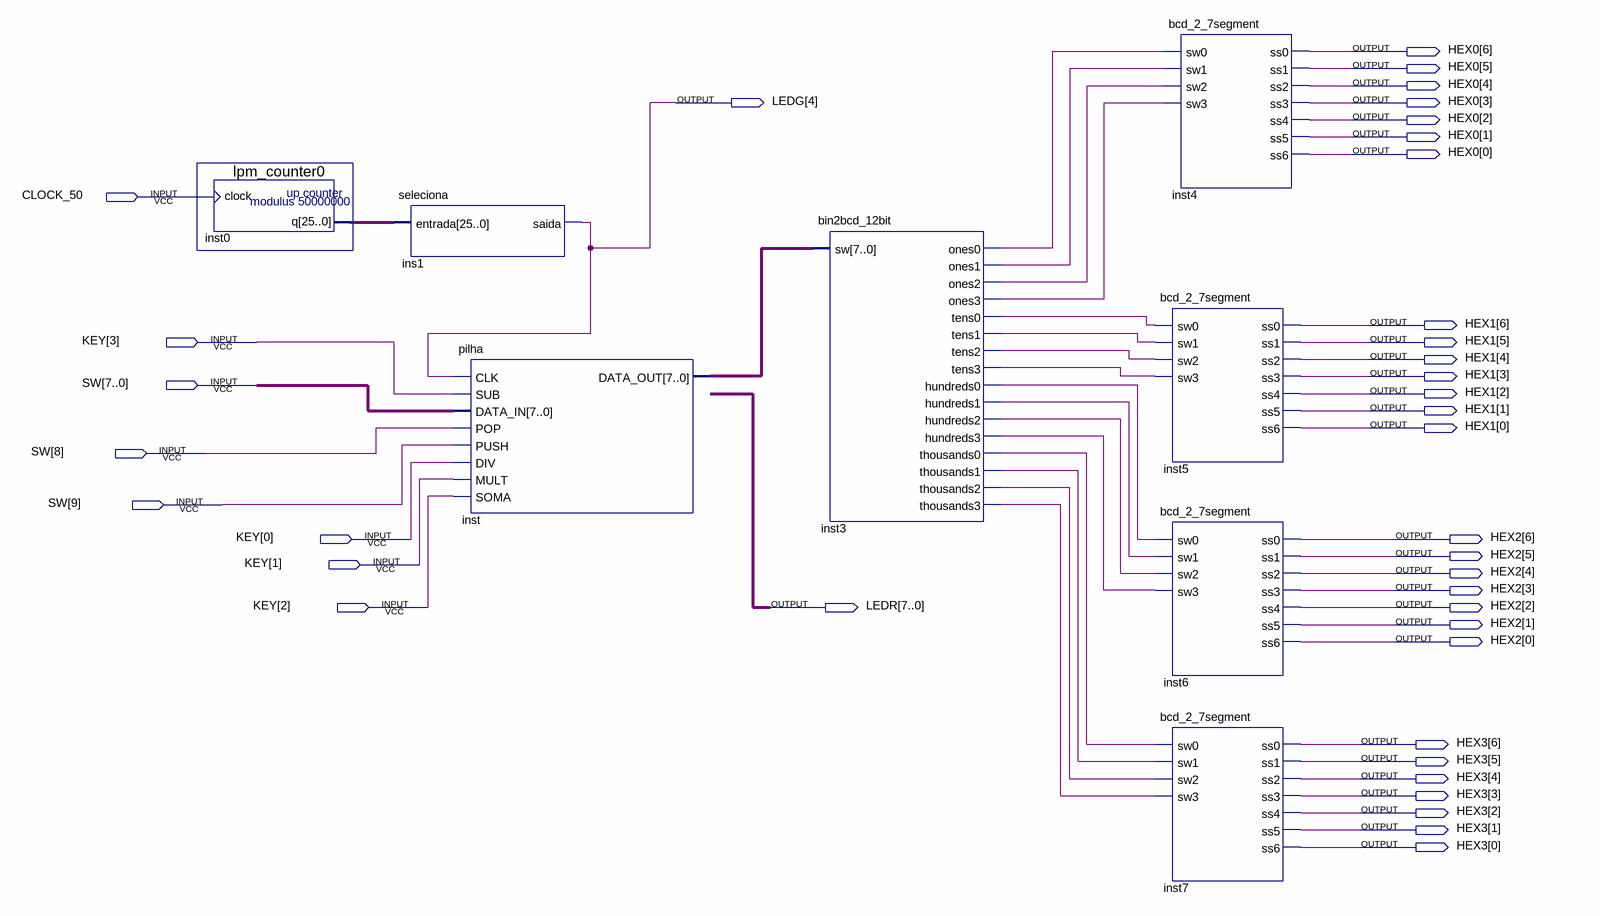
[diagram p0: schematic sheet]
// Quartus schematic bcd.bdf as structural Verilog: 8 symbols, 38 pins
module bcd (
  input  CLOCK_50,
  input  [3:0] KEY,
  input  [9:0] SW,
  output [6:0] HEX0,
  output [4:4] LEDG,
  output [6:0] HEX1,
  output [6:0] HEX2,
  output [7:0] LEDR,
  output [6:0] HEX3
);

  wire inst3_hundreds0, inst3_hundreds1, inst3_hundreds2, inst3_hundreds3, inst3_ones0, inst3_ones1,
       inst3_ones2, inst3_ones3, inst3_tens0, inst3_tens1, inst3_tens2, inst3_tens3, inst3_thousands0,
       inst3_thousands1, inst3_thousands2, inst3_thousands3;
  wire [7:0] inst_data_out;
  wire [25:0] inst0_q;

  lpm_counter0 inst0 (.clock(CLOCK_50), .q(inst0_q));
  seleciona ins1 (.entrada(inst0_q), .saida(LEDG[4]));
  pilha inst (
    .CLK(LEDG[4]), .SUB(KEY[3]), .DATA_IN(SW[7:0]), .POP(SW[8]), .PUSH(SW[9]), .DIV(KEY[0]), .MULT(KEY[1]),
    .SOMA(KEY[2]), .DATA_OUT(inst_data_out));
  bin2bcd_12bit inst3 (
    .sw(inst_data_out), .ones0(inst3_ones0), .ones1(inst3_ones1), .ones2(inst3_ones2), .ones3(inst3_ones3),
    .tens0(inst3_tens0), .tens1(inst3_tens1), .tens2(inst3_tens2), .tens3(inst3_tens3),
    .hundreds0(inst3_hundreds0), .hundreds1(inst3_hundreds1), .hundreds2(inst3_hundreds2),
    .hundreds3(inst3_hundreds3), .thousands0(inst3_thousands0), .thousands1(inst3_thousands1),
    .thousands2(inst3_thousands2), .thousands3(inst3_thousands3));
  bcd_2_7segment inst4 (
    .sw0(inst3_ones0), .sw1(inst3_ones1), .sw2(inst3_ones2), .sw3(inst3_ones3), .ss0(HEX0[6]), .ss1(HEX0[5]),
    .ss2(HEX0[4]), .ss3(HEX0[3]), .ss4(HEX0[2]), .ss5(HEX0[1]), .ss6(HEX0[0]));
  bcd_2_7segment inst5 (
    .sw0(inst3_tens0), .sw1(inst3_tens1), .sw2(inst3_tens2), .sw3(inst3_tens3), .ss0(HEX1[6]), .ss1(HEX1[5]),
    .ss2(HEX1[4]), .ss3(HEX1[3]), .ss4(HEX1[2]), .ss5(HEX1[1]), .ss6(HEX1[0]));
  bcd_2_7segment inst6 (
    .sw0(inst3_hundreds0), .sw1(inst3_hundreds1), .sw2(inst3_hundreds2), .sw3(inst3_hundreds3),
    .ss0(HEX2[6]), .ss1(HEX2[5]), .ss2(HEX2[4]), .ss3(HEX2[3]), .ss4(HEX2[2]), .ss5(HEX2[1]), .ss6(HEX2[0]));
  bcd_2_7segment inst7 (
    .sw0(inst3_thousands0), .sw1(inst3_thousands1), .sw2(inst3_thousands2), .sw3(inst3_thousands3),
    .ss0(HEX3[6]), .ss1(HEX3[5]), .ss2(HEX3[4]), .ss3(HEX3[3]), .ss4(HEX3[2]), .ss5(HEX3[1]), .ss6(HEX3[0]));
endmodule
